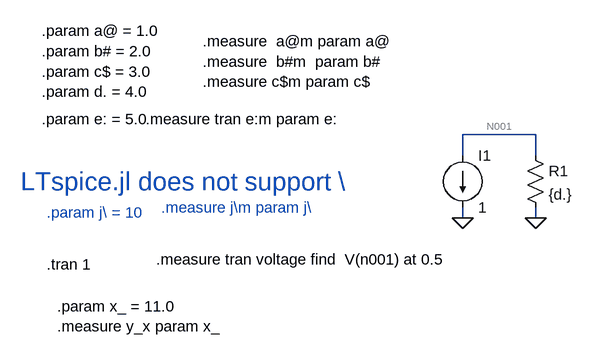
[diagram p0: schematic test8.asc]
test8.asc, the LTspice schematic file:
Version 4
SHEET 1 1084 680
WIRE 560 112 448 112
WIRE 448 144 448 112
WIRE 560 144 560 112
WIRE 448 240 448 224
WIRE 560 240 560 224
FLAG 448 240 0
FLAG 560 240 0
SYMBOL current 448 144 R0
WINDOW 123 0 0 Left 2
WINDOW 39 0 0 Left 2
SYMATTR InstName I1
SYMATTR Value 1
SYMBOL res 544 128 R0
SYMATTR InstName R1
SYMATTR Value {d.}
TEXT -200 -48 Left 2 !.param a@ = 1.0\n.param b# = 2.0\n.param c$ = 3.0\n.param d. = 4.0
TEXT -200 88 Left 2 !.param e: = 5.0
TEXT -192 232 Left 2 ;.param j\\ = 10
TEXT 48 -32 Left 2 !.measure  a@m param a@\n.measure  b#m  param b#\n.measure c$m param c$
TEXT -192 312 Left 2 !.tran 1
TEXT -40 88 Left 2 !.measure tran e:m param e:
TEXT -16 224 Left 2 ;.measure j\\m param j\\
TEXT -24 304 Left 2 !.measure tran voltage find  V(n001) at 0.5
TEXT -232 184 Left 4 ;LTspice.jl does not support \\
TEXT -176 376 Left 2 !.param x_ = 11.0\n.measure y_x param x_

The netlist it stands for:
* test8.asc
I1 N001 0 1
R1 N001 0 {d.}
.param a@ = 1.0
.param b# = 2.0
.param c$ = 3.0
.param d. = 4.0
.param e: = 5.0
* .param j\ = 10
.measure  a@m param a@
.measure  b#m  param b#
.measure c$m param c$
.tran 1
.measure tran e:m param e:
* .measure j\m param j\
.measure tran voltage find  V(n001) at 0.5
* LTspice.jl does not support \
.param x_ = 11.0
.measure y_x param x_
.backanno
.end